# Altium schematic sheet AUX_CONNECTOR.SchDoc
size Letter; SheetNumber: 2; SheetTotal: 5
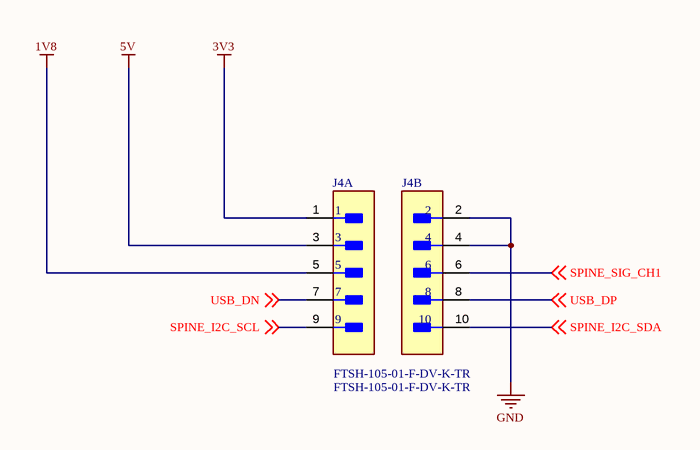
[diagram p0: AUX_CONNECTOR.SchDoc]

## Parts
J4  FTSH-105-01-F-DV-K-TR  [FP-FTSH-105-01-F-DV-K-TR-MFG]  (parts A,B of 2)

## Nets
1V8: J4.5
3V3: J4.1
5V: J4.3
GND: J4.2 J4.4
SPINE_I2C_SCL: J4.9 ; off-sheet SPINE_I2C_SCL
SPINE_I2C_SDA: J4.10 ; off-sheet SPINE_I2C_SDA
SPINE_SIG_CH1: J4.6 ; off-sheet SPINE_SIG_CH1
USB_DN: J4.7 ; off-sheet USB_DN
USB_DP: J4.8 ; off-sheet USB_DP

## Notes on the sheet
- Title
- Copyright (c) Meta Platforms, Inc. and affiliates.
  All rights reserved.
  This source code is licensed under the license found in the
  LICENSE file in the root directory of this source tree.
- Sheet
- of

## Library data of the parts
J4 = CMP-02766-000004-2: CONN HEADER SMD 10POS 1.27MM; Number of Contacts: 10; Max Current Rating: 1.75A; Max Operating Temperature: 125°C; Number of Rows: 2; Pitch: 1.27mm; Contact Plating: Gold; Length: 6.35mm; Min Operating Temperature: -55°C; Packaging: Tape and Reel; Orientation: Straight; Contact Material: Bronze; Depth: 3.43mm; Housing Color: Black; Housing Material: Polymer; Radiation Hardening: No; Termination: Solder; Lead Free: Lead Free